# EAGLE design TSAL_logic_TNN_V1.0 (EAGLE 9.6.2)
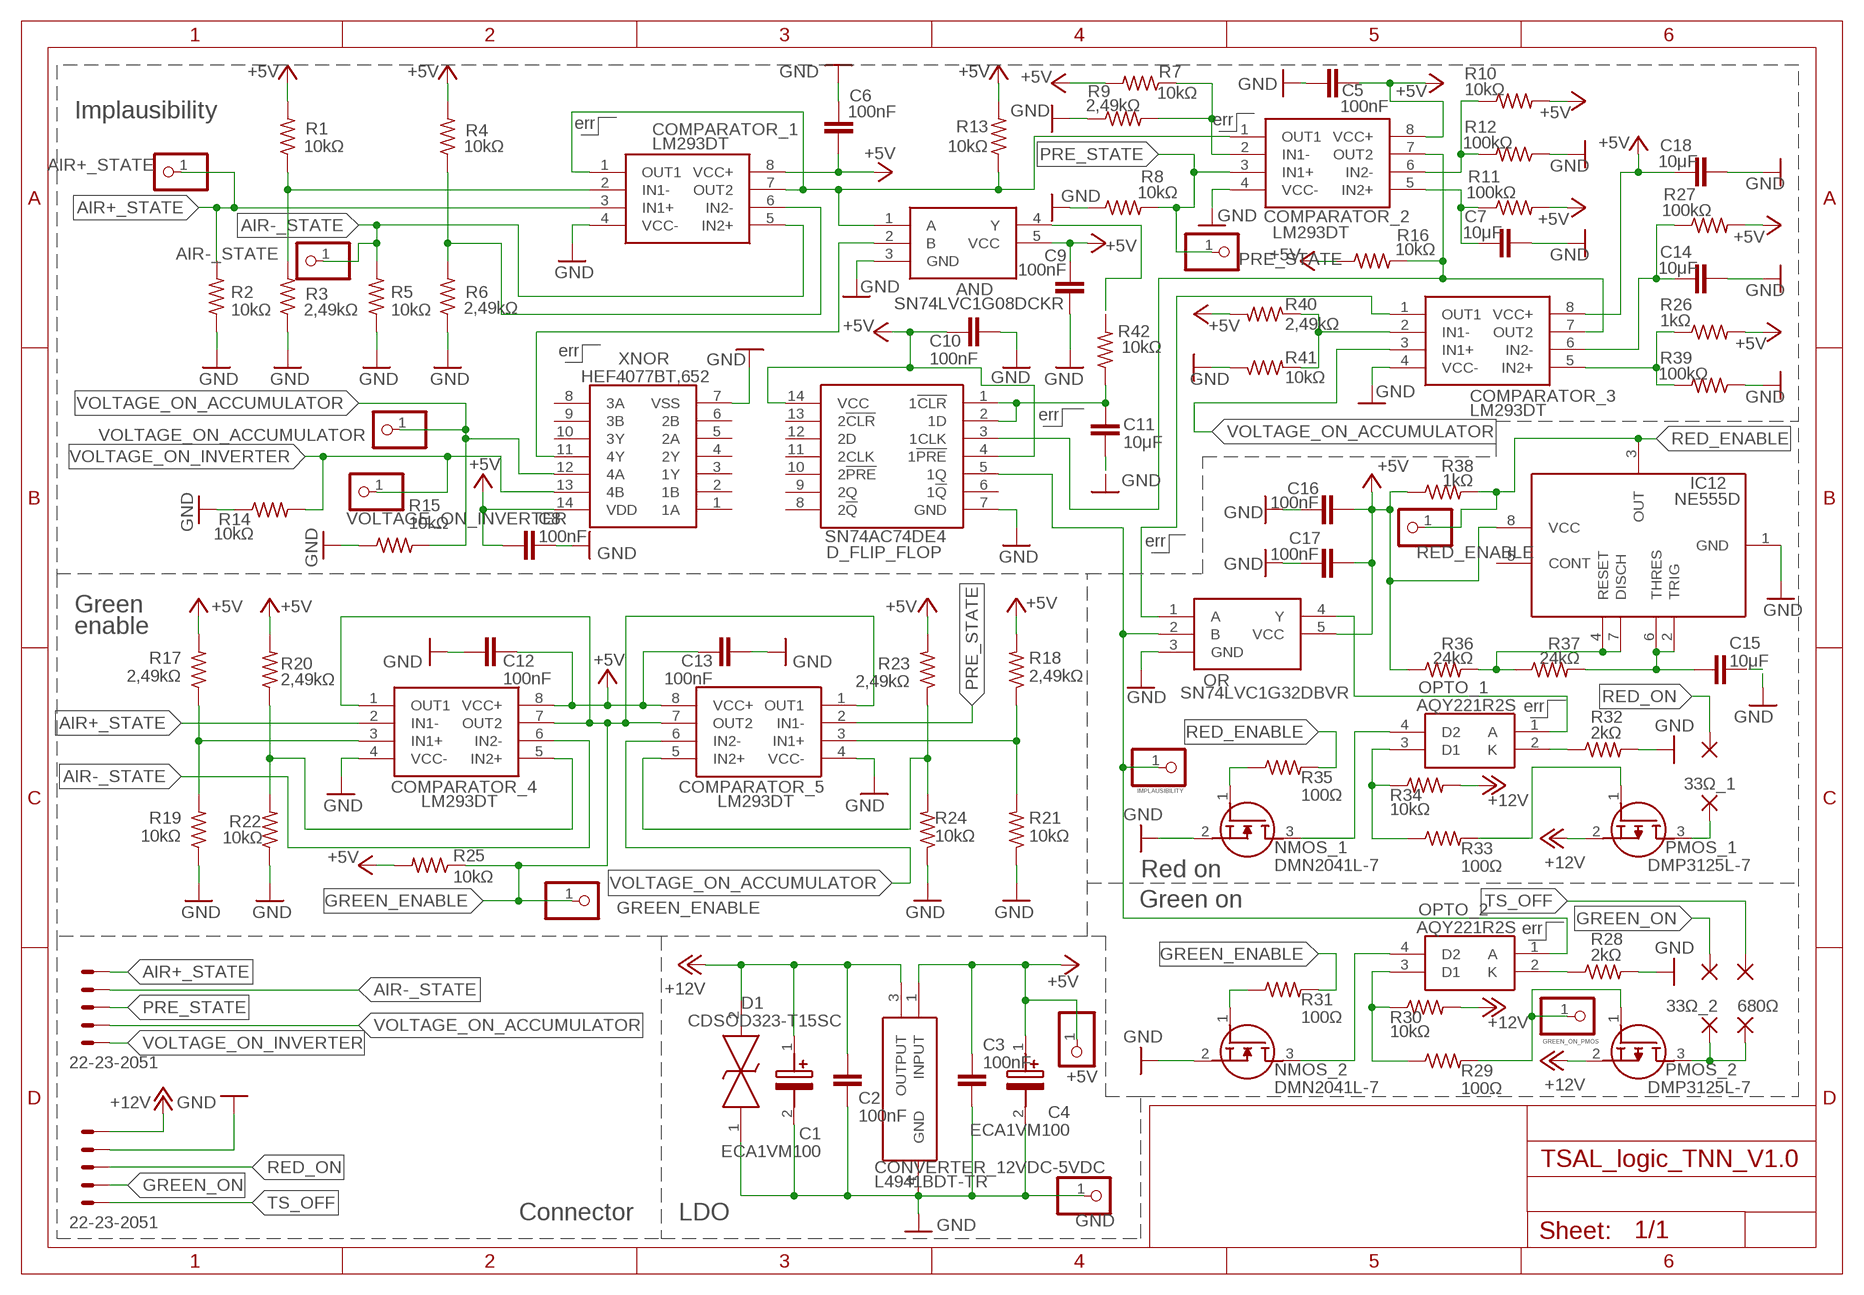
[diagram p0: schematic, sheet 1]

## Parts
33Ω_1  1,6/0,8  [1,6/0,8]
33Ω_1_  1,6/0,8  [1,6/0,8]
33Ω_2  1,6/0,8  [1,6/0,8]
33Ω_2_  1,6/0,8  [1,6/0,8]
680Ω  1,6/0,8  [1,6/0,8]
680Ω_  1,6/0,8  [1,6/0,8]
+5V  PINHD-1X1  [1X01]
AIR+_STATE  PINHD-1X1  [1X01]
AIR-_STATE  PINHD-1X1  [1X01]
AND  SN74LVC1G08DCKR  [SOT65P210X110-5N]
C1  ECA1VM100  [CAPPRD200W55D525H1200]
C2  100nF  C-EUC0603  [C0603]
C3  100nF  C-EUC0603  [C0603]
C4  ECA1VM100  [CAPPRD200W55D525H1200]
C5  100nF  C-EUC0603  [C0603]
C6  100nF  C-EUC0603  [C0603]
C7  10μF  C-EUC0603  [C0603]
C8  100nF  C-EUC0603  [C0603]
C9  100nF  C-EUC0603  [C0603]
C10  100nF  C-EUC0603  [C0603]
C11  10μF  C-EUC0603  [C0603]
C12  100nF  C-EUC0603  [C0603]
C13  100nF  C-EUC0603  [C0603]
C14  10μF  C-EUC0603  [C0603]
C15  10μF  C-EUC0603  [C0603]
C16  100nF  C-EUC0603  [C0603]
C17  100nF  C-EUC0603  [C0603]
C18  10μF  C-EUC0603  [C0603]
COMPARATOR_1  LM293DT  [SOIC127P600X175-8N]
COMPARATOR_2  LM293DT  [SOIC127P600X175-8N]
COMPARATOR_3  LM293DT  [SOIC127P600X175-8N]
COMPARATOR_4  LM293DT  [SOIC127P600X175-8N]
COMPARATOR_5  LM293DT  [SOIC127P600X175-8N]
CONTACTOR_STATE_AND_VOLTAGE_MEASUREMENT  22-23-2051  [22-23-2051]
CONVERTER_12VDC-5VDC  L4941BDT-TR  [TO228P972X240-3N]
D1  CDSOD323-T15SC  [SOD-323]
D_FLIP_FLOP  SN74AC74DE4  [SOIC127P600X175-14N]
GND  PINHD-1X1  [1X01]
GREEN_ENABLE  PINHD-1X1  [1X01]
GREEN_ON_PMOS  PINHD-1X1  [1X01]
IC12  NE555D  [SOIC127P600X175-8N]
IMPLAUSIBILITY  PINHD-1X1  [1X01]
NMOS_1  DMN2041L-7  [SOT96P240X110-3N]
NMOS_2  DMN2041L-7  [SOT96P240X110-3N]
OPTO_1  AQY221R2S  [SOP254P680X230-4N]
OPTO_2  AQY221R2S  [SOP254P680X230-4N]
OR  SN74LVC1G32DBVR  [SOT95P280X145-5N]
PMOS_1  DMP3125L-7  [SOT96P240X110-3N]
PMOS_2  DMP3125L-7  [SOT96P240X110-3N]
PRE_STATE  PINHD-1X1  [1X01]
R1  10kΩ  R-US_R0603  [R0603]
R2  10kΩ  R-US_R0603  [R0603]
R3  2,49kΩ  R-US_R0603  [R0603]
R4  10kΩ  R-US_R0603  [R0603]
R5  10kΩ  R-US_R0603  [R0603]
R6  2,49kΩ  R-US_R0603  [R0603]
R7  10kΩ  R-US_R0603  [R0603]
R8  10kΩ  R-US_R0603  [R0603]
R9  2,49kΩ  R-US_R0603  [R0603]
R10  10kΩ  R-US_R0603  [R0603]
R11  100kΩ  R-US_R0603  [R0603]
R12  100kΩ  R-US_R0603  [R0603]
R13  10kΩ  R-US_R0603  [R0603]
R14  10kΩ  R-US_R0603  [R0603]
R15  10kΩ  R-US_R0603  [R0603]
R16  10kΩ  R-US_R0603  [R0603]
R17  2,49kΩ  R-US_R0603  [R0603]
R18  2,49kΩ  R-US_R0603  [R0603]
R19  10kΩ  R-US_R0603  [R0603]
R20  2,49kΩ  R-US_R0603  [R0603]
R21  10kΩ  R-US_R0603  [R0603]
R22  10kΩ  R-US_R0603  [R0603]
R23  2,49kΩ  R-US_R0603  [R0603]
R24  10kΩ  R-US_R0603  [R0603]
R25  10kΩ  R-US_R0603  [R0603]
R26  1kΩ  R-US_R0603  [R0603]
R27  100kΩ  R-US_R0603  [R0603]
R28  2kΩ  R-US_R0603  [R0603]
R29  100Ω  R-US_R0603  [R0603]
R30  10kΩ  R-US_R0603  [R0603]
R31  100Ω  R-US_R0603  [R0603]
R32  2kΩ  R-US_R0603  [R0603]
R33  100Ω  R-US_R0603  [R0603]
R34  10kΩ  R-US_R0603  [R0603]
R35  100Ω  R-US_R0603  [R0603]
R36  24kΩ  R-US_R0603  [R0603]
R37  24kΩ  R-US_R0603  [R0603]
R38  1kΩ  R-US_R0603  [R0603]
R39  100kΩ  R-US_R0603  [R0603]
R40  2,49kΩ  R-US_R0603  [R0603]
R41  10kΩ  R-US_R0603  [R0603]
R42  10kΩ  R-US_R0603  [R0603]
RED_ENABLE  PINHD-1X1  [1X01]
TSAL_LED_AND_POWER  22-23-2051  [22-23-2051]
VOLTAGE_ON_ACCUMULATOR  PINHD-1X1  [1X01]
VOLTAGE_ON_INVERTER  PINHD-1X1  [1X01]
XNOR  HEF4077BT,652  [SOIC127P600X175-14N]

## Nets
+5V: +5V.1 AND.5(VCC) C3.1 C4.1(+) C5.2 C6.2 C8.1 C9.1 C10.1 C12.1 C13.1 C16.1 C17.1 C18.1 COMPARATOR_1.8(VCC+) COMPARATOR_2.8(VCC+) COMPARATOR_3.8(VCC+) COMPARATOR_4.8(VCC+) COMPARATOR_5.8(VCC+) CONVERTER_12VDC-5VDC.1(INPUT) D_FLIP_FLOP.4(1!PRE) D_FLIP_FLOP.14(VCC) IC12.8(VCC) OR.5(VCC) R1.2 R4.2 R7.2 R10.2 R11.2 R13.2 R16.1 R17.2 R18.2 R20.2 R23.2 R25.2 R26.2 R27.2 R36.1 R38.1 R40.2 XNOR.14(VDD)
+12V: C1.1(+) C2.1 CONVERTER_12VDC-5VDC.3(OUTPUT) D1.2 PMOS_1.2(S) PMOS_2.2(S) R30.2 R34.2 TSAL_LED_AND_POWER.5
AIR+_STATE: AIR+_STATE.1 COMPARATOR_1.3(IN1+) COMPARATOR_4.2(IN1-) CONTACTOR_STATE_AND_VOLTAGE_MEASUREMENT.5 R2.2
AIR-_STATE: AIR-_STATE.1 COMPARATOR_1.5(IN2+) COMPARATOR_4.6(IN2-) CONTACTOR_STATE_AND_VOLTAGE_MEASUREMENT.4 R5.2
GND: AND.3(GND) C1.2(-) C2.2 C3.2 C4.2(-) C5.1 C6.1 C7.2 C8.2 C9.2 C10.2 C11.2 C12.2 C13.2 C14.2 C15.2 C16.2 C17.2 C18.2 COMPARATOR_1.4(VCC-) COMPARATOR_2.4(VCC-) COMPARATOR_3.4(VCC-) COMPARATOR_4.4(VCC-) COMPARATOR_5.4(VCC-) CONVERTER_12VDC-5VDC.4(GND) D1.1 D_FLIP_FLOP.7(GND) GND.1 IC12.1(GND) NMOS_1.2(S) NMOS_2.2(S) OR.3(GND) R2.1 R3.1 R5.1 R6.1 R8.1 R9.1 R12.1 R14.1 R15.1 R19.1 R21.1 R22.1 R24.1 R28.2 R32.2 R39.1 R41.1 TSAL_LED_AND_POWER.4 XNOR.7(VSS)
GREEN_ENABLE: COMPARATOR_4.1(OUT1) COMPARATOR_4.7(OUT2) COMPARATOR_5.1(OUT1) COMPARATOR_5.7(OUT2) GREEN_ENABLE.1 R25.1 R31.2
GREEN_ON: 33Ω_2_.1(P) TSAL_LED_AND_POWER.2
IMPLAUSIBILITY: D_FLIP_FLOP.5(1Q) IMPLAUSIBILITY.1 OPTO_2.1(A) OR.2(B)
N$1: COMPARATOR_1.2(IN1-) R1.1 R3.2
N$2: AND.1(A) COMPARATOR_1.1(OUT1) COMPARATOR_1.7(OUT2) COMPARATOR_2.1(OUT1) R13.1
N$3: COMPARATOR_1.6(IN2-) R4.1 R6.2
N$4: COMPARATOR_2.2(IN1-) R7.1 R9.2
N$5: COMPARATOR_2.6(IN2-) R10.1 R12.2
N$6: C7.1 COMPARATOR_2.5(IN2+) R11.1
N$7: COMPARATOR_2.7(OUT2) COMPARATOR_3.7(OUT2) D_FLIP_FLOP.3(1CLK) R16.2
N$8: AND.2(B) XNOR.11(4Y)
N$9: COMPARATOR_5.5(IN2+) R23.1 R24.2
N$10: COMPARATOR_5.3(IN1+) R18.1 R21.2
N$11: COMPARATOR_4.3(IN1+) R17.1 R19.2
N$12: COMPARATOR_4.5(IN2+) R20.1 R22.2
N$14: COMPARATOR_3.5(IN2+) R26.1 R39.2
N$15: 33Ω_2.1(P) 680Ω.1(P) PMOS_2.3(D)
N$16: OPTO_2.2(K) R28.1
N$17: 33Ω_1.1(P) PMOS_1.3(D)
N$18: NMOS_2.3(D) OPTO_2.4(D2)
N$19: OPTO_2.3(D1) R29.1 R30.1
N$20: GREEN_ON_PMOS.1 PMOS_2.1(G) R29.2
N$21: NMOS_2.1(G) R31.1
N$22: NMOS_1.3(D) OPTO_1.4(D2)
N$23: OPTO_1.3(D1) R33.1 R34.1
N$24: PMOS_1.1(G) R33.2
N$25: NMOS_1.1(G) R35.1
N$26: OPTO_1.2(K) R32.1
N$27: COMPARATOR_3.1(OUT1) OR.1(A)
N$28: OPTO_1.1(A) OR.4(Y)
N$30: C14.1 COMPARATOR_3.6(IN2-) R27.1
N$31: C15.1 IC12.2(TRIG) IC12.6(THRES) R37.2
N$32: IC12.4(RESET) IC12.7(DISCH) R36.2 R37.1
N$33: COMPARATOR_3.2(IN1-) R40.1 R41.2
N$34: C11.1 D_FLIP_FLOP.1(1!CLR) D_FLIP_FLOP.2(1D) R42.1
N$35: AND.4(Y) R42.2
PRE_STATE: COMPARATOR_2.3(IN1+) COMPARATOR_5.2(IN1-) CONTACTOR_STATE_AND_VOLTAGE_MEASUREMENT.3 PRE_STATE.1 R8.2
RED_ENABLE: IC12.3(OUT) R35.2 R38.2 RED_ENABLE.1
RED_ON: 33Ω_1_.1(P) TSAL_LED_AND_POWER.3
TS_OFF: 680Ω_.1(P) TSAL_LED_AND_POWER.1
VOLTAGE_ON_ACCUMULATOR: COMPARATOR_3.3(IN1+) COMPARATOR_5.6(IN2-) CONTACTOR_STATE_AND_VOLTAGE_MEASUREMENT.2 R15.2 VOLTAGE_ON_ACCUMULATOR.1 XNOR.12(4A)
VOLTAGE_ON_INVERTER: CONTACTOR_STATE_AND_VOLTAGE_MEASUREMENT.1 R14.2 VOLTAGE_ON_INVERTER.1 XNOR.13(4B)
Unconnected: D_FLIP_FLOP.6(1!Q) D_FLIP_FLOP.8(2!Q) D_FLIP_FLOP.9(2Q) D_FLIP_FLOP.10(2!PRE) D_FLIP_FLOP.11(2CLK) D_FLIP_FLOP.12(2D) D_FLIP_FLOP.13(2!CLR) IC12.5(CONT) XNOR.1(1A) XNOR.2(1B) XNOR.3(1Y) XNOR.4(2Y) XNOR.5(2A) XNOR.6(2B) XNOR.8(3A) XNOR.9(3B) XNOR.10(3Y)

## Notes on the sheet
- err | err
- Implausibility
- err
- err
- err
- Green 
  enable
- err
- Red on
- Green on
- err
- Connector | LDO

## Library data of the parts
33Ω_1 33Ω_1_ 33Ω_2 33Ω_2_ 680Ω 680Ω_ = wirepad:1,6/0,8: THROUGH-HOLE PAD
+5V AIR+_STATE AIR-_STATE GND GREEN_ENABLE GREEN_ON_PMOS IMPLAUSIBILITY PRE_STATE RED_ENABLE VOLTAGE_ON_ACCUMULATOR VOLTAGE_ON_INVERTER = pinhead:PINHD-1X1: PIN HEADER
AND = SN74LVC1G08DCKR:SN74LVC1G08DCKR: Single 2-Input Positive-AND Gate Source: Datasheet <http://www.ti.com/lit/gpn/sn74lvc1g08>; ARROW_PART_NUMBER: SN74LVC1G08DCKR; ARROW_PRICE-STOCK: https://www.arrow.com/en/products/sn74lvc1g08dckr/texas-instruments?region=nac; DESCRIPTION: Single 2-Input Positive-AND Gate; HEIGHT: 1.1mm; MANUFACTURER_NAME: Texas Instruments; MANUFACTURER_PART_NUMBER: SN74LVC1G08DCKR; MOUSER_PART_NUMBER: 595-SN74LVC1G08DCKR; MOUSER_PRICE-STOCK: https://www.mouser.co.uk/ProductDetail/Texas-Instruments/SN74LVC1G08DCKR?qs=sbcp%2F4gpy0%2F8FFQ%252BRQ5MTw%3D%3D
C1 C4 = ECA1VM100:ECA1VM100: M radial Al elect cap,10uF 35V 85deg C Panasonic 10uF 35 V dc Aluminium Electrolytic Capacitor, M Series 2000h Source: Datasheet <http://industrial.panasonic.com/cdbs/www-data/pdf/RDF0000/ABA0000C1218.pdf>; DESCRIPTION: M radial Al elect cap,10uF 35V 85deg C Panasonic 10uF 35 V dc Aluminium Electrolytic Capacitor, M Series 2000h; HEIGHT: 12mm; MANUFACTURER_NAME: Panasonic; MANUFACTURER_PART_NUMBER: ECA1VM100
C2 C3 C5-C18 = rcl:C-EU: CAPACITOR, European symbol; SPICEPREFIX: C
COMPARATOR_1-COMPARATOR_5 = LM293DT:LM293DT: Low power dual voltage comparators Source: Datasheet <http://www.st.com/web/en/resource/technical/document/datasheet/CD00000465.pdf>; ARROW_PART_NUMBER: LM293DT; ARROW_PRICE-STOCK: https://www.arrow.com/en/products/lm293dt/stmicroelectronics?region=europe; DESCRIPTION: Low power dual voltage comparators; HEIGHT: 1.75mm; MANUFACTURER_NAME: STMicroelectronics; MANUFACTURER_PART_NUMBER: LM293DT; MOUSER_PART_NUMBER: 511-LM293DT; MOUSER_PRICE-STOCK: https://www.mouser.co.uk/ProductDetail/STMicroelectronics/LM293DT?qs=8Bu%252BF5HPnlzADNRUf2Meow%3D%3D
CONTACTOR_STATE_AND_VOLTAGE_MEASUREMENT TSAL_LED_AND_POWER = con-molex:22-23-2051: .100" (2.54mm) Center Header - 5 Pin; MF: MOLEX; MPN: 22-23-2051; OC_FARNELL: 1462952; OC_NEWARK: 38C9178
CONVERTER_12VDC-5VDC = L4941BDT-TR:L4941BDT-TR: L4941BDT-TR, Low Dropout Voltage Regulator, 1A, 5 V +/-4%, 3-Pin DPAK Source: Datasheet <http://www.st.com/web/en/resource/technical/document/datasheet/CD00000443.pdf>; ARROW_PART_NUMBER: L4941BDT-TR; ARROW_PRICE-STOCK: https://www.arrow.com/en/products/l4941bdt-tr/stmicroelectronics?region=nac; DESCRIPTION: L4941BDT-TR, Low Dropout Voltage Regulator, 1A, 5 V +/-4%, 3-Pin DPAK; HEIGHT: 2.4mm; MANUFACTURER_NAME: STMicroelectronics; MANUFACTURER_PART_NUMBER: L4941BDT-TR; MOUSER_PART_NUMBER: 511-L4941BDT-TR; MOUSER_PRICE-STOCK: https://www.mouser.co.uk/ProductDetail/STMicroelectronics/L4941BDT-TR?qs=tPFdqECvbMIySYN92F2N4Q%3D%3D
D1 = CDSOD323-T15SC:CDSOD323-T15SC: TVS Diode ESD 15V BiDirectional SOD323 Bourns CDSOD323-T15SC Bi-Directional TVS Diode, 400W peak, 2-Pin SOD-323 Source: Datasheet <https://datasheet.datasheetarchive.com/originals/distributors/Datasheets-DGA26/1841678.pdf>; ARROW_PART_NUMBER: CDSOD323-T15SC; ARROW_PRICE-STOCK: https://www.arrow.com/en/products/cdsod323-t15sc/bourns?region=nac; DESCRIPTION: TVS Diode ESD 15V BiDirectional SOD323 Bourns CDSOD323-T15SC Bi-Directional TVS Diode, 400W peak, 2-Pin SOD-323; HEIGHT: mm; MANUFACTURER_NAME: Bourns; MANUFACTURER_PART_NUMBER: CDSOD323-T15SC; MOUSER_PART_NUMBER: 652-CDSOD323-T15SC; MOUSER_PRICE-STOCK: https://www.mouser.co.uk/ProductDetail/Bourns/CDSOD323-T15SC?qs=6S5Watp5UnLvz%2FtnS7XuhA%3D%3D
D_FLIP_FLOP = SN74AC74DE4:SN74AC74DE4: Flip-Flops Dual Pos-Edge-Trig D-Type Flip-Flop Source: Datasheet <http://www.ti.com/general/docs/suppproductinfo.tsp?distId=26&gotoUrl=http://www.ti.com/lit/gpn/sn74ac74>; DESCRIPTION: Flip-Flops Dual Pos-Edge-Trig D-Type Flip-Flop; HEIGHT: 1.75mm; MANUFACTURER_NAME: Texas Instruments; MANUFACTURER_PART_NUMBER: SN74AC74DE4; MOUSER_PART_NUMBER: 595-SN74AC74DE4; MOUSER_PRICE-STOCK: https://www.mouser.co.uk/ProductDetail/Texas-Instruments/SN74AC74DE4?qs=pdM4geFiyZSonhSZLAytyw%3D%3D
IC12 = NE555D:NE555D: NE555DG4, Timer, 4.5 to 16V, 8-Pin SOIC-8 Source: Datasheet <http://www.ti.com/lit/ds/symlink/ne555.pdf>; ARROW_PART_NUMBER: NE555D; ARROW_PRICE-STOCK: https://www.arrow.com/en/products/ne555d/texas-instruments?region=nac; DESCRIPTION: NE555DG4, Timer, 4.5 to 16V, 8-Pin SOIC-8; HEIGHT: 1.75mm; MANUFACTURER_NAME: Texas Instruments; MANUFACTURER_PART_NUMBER: NE555D; MOUSER_PART_NUMBER: 595-NE555D; MOUSER_PRICE-STOCK: https://www.mouser.co.uk/ProductDetail/Texas-Instruments/NE555D?qs=gb35HGp1gQIV8t3Z88o0WA%3D%3D
NMOS_1 NMOS_2 = DMN2041L-7:DMN2041L-7: Diodes Inc DMN2041L-7 N-channel MOSFET Transistor, 6.4 A, 20 V, 3-Pin SOT-23 Source: Datasheet <https://datasheet.datasheetarchive.com/originals/distributors/Datasheets-DGA23/1582050.pdf>; ARROW_PART_NUMBER: DMN2041L-7; ARROW_PRICE-STOCK: https://www.arrow.com/en/products/dmn2041l-7/diodes-incorporated?region=nac; DESCRIPTION: Diodes Inc DMN2041L-7 N-channel MOSFET Transistor, 6.4 A, 20 V, 3-Pin SOT-23; HEIGHT: 1.1mm; MANUFACTURER_NAME: Diodes Inc.; MANUFACTURER_PART_NUMBER: DMN2041L-7; MOUSER_PART_NUMBER: 621-DMN2041L-7; MOUSER_PRICE-STOCK: https://www.mouser.co.uk/ProductDetail/Diodes-Incorporated/DMN2041L-7?qs=tiksPeNXt0LSbn3jTreVOg%3D%3D
OPTO_1 OPTO_2 = AQY221R2S:AQY221R2S: SPST-NO Solid State Relay 250 mA PCB Mount PhotoMOS, 1.5 V Source: Datasheet <https://datasheet.datasheetarchive.com/originals/distributors/SFDatasheet-4/sf-00084072.pdf>; ARROW_PART_NUMBER: AQY221R2S; ARROW_PRICE-STOCK: https://www.arrow.com/en/products/aqy221r2s/panasonic; DESCRIPTION: SPST-NO Solid State Relay 250 mA PCB Mount PhotoMOS, 1.5 V; HEIGHT: 2.3mm; MANUFACTURER_NAME: Panasonic; MANUFACTURER_PART_NUMBER: AQY221R2S; MOUSER_PART_NUMBER: 769-AQY221R2S; MOUSER_PRICE-STOCK: https://www.mouser.co.uk/ProductDetail/Panasonic-Industrial-Devices/AQY221R2S?qs=mTeSeKeuVA570TSPtWARNQ%3D%3D
OR = SN74LVC1G32DBVR:SN74LVC1G32DBVR: Texas Instruments SN74LVC1G32DBVR, 2-Input OR Logic Gate, 1.65 5.5 V, 5-Pin SOT-23 Source: Datasheet <http://www.ti.com/lit/gpn/sn74lvc1g32>; ARROW_PART_NUMBER: SN74LVC1G32DBVR; ARROW_PRICE-STOCK: https://www.arrow.com/en/products/sn74lvc1g32dbvr/texas-instruments?region=nac; DESCRIPTION: Texas Instruments SN74LVC1G32DBVR, 2-Input OR Logic Gate, 1.65 5.5 V, 5-Pin SOT-23; HEIGHT: 1.45mm; MANUFACTURER_NAME: Texas Instruments; MANUFACTURER_PART_NUMBER: SN74LVC1G32DBVR; MOUSER_PART_NUMBER: 595-SN74LVC1G32DBVR; MOUSER_PRICE-STOCK: https://www.mouser.co.uk/ProductDetail/Texas-Instruments/SN74LVC1G32DBVR?qs=3pnr37ZAbK%2F6ArGi%2FPb2Ng%3D%3D
PMOS_1 PMOS_2 = DMP3125L-7:DMP3125L-7: DMP3125L-7 P-Channel MOSFET, 2 (State) A, 2.5 (Steady) A, 30 V, 3-Pin SOT-23 Diodes Inc Source: Datasheet <http://uk.rs-online.com/web/p/products/1826917>; ARROW_PART_NUMBER: DMP3125L-7; ARROW_PRICE-STOCK: https://www.arrow.com/en/products/dmp3125l-7/diodes-incorporated; DESCRIPTION: DMP3125L-7 P-Channel MOSFET, 2 (State) A, 2.5 (Steady) A, 30 V, 3-Pin SOT-23 Diodes Inc; HEIGHT: 1.1mm; MANUFACTURER_NAME: Diodes Inc.; MANUFACTURER_PART_NUMBER: DMP3125L-7; MOUSER_PART_NUMBER: 621-DMP3125L-7; MOUSER_PRICE-STOCK: https://www.mouser.co.uk/ProductDetail/Diodes-Incorporated/DMP3125L-7?qs=W0yvOO0ixfH8ma8MdHfXQA%3D%3D
R1-R42 = rcl:R-US_: RESISTOR, American symbol; SPICEPREFIX: R
XNOR = HEF4077BT_652:HEF4077BT,652: NXP HEF4077BT,652, XNOR Quad 2 Input XNOR, 3 15 V, 14-Pin SOIC Source: Datasheet <https://assets.nexperia.com/documents/data-sheet/HEF4077B.pdf>; ARROW_PART_NUMBER: HEF4077BT,652; ARROW_PRICE-STOCK: https://www.arrow.com/en/products/hef4077bt652/nexperia; DESCRIPTION: NXP HEF4077BT,652, XNOR Quad 2 Input XNOR, 3 15 V, 14-Pin SOIC; HEIGHT: 1.75mm; MANUFACTURER_NAME: Nexperia; MANUFACTURER_PART_NUMBER: HEF4077BT,652; MOUSER_PART_NUMBER: 771-HEF4077BTD; MOUSER_PRICE-STOCK: https://www.mouser.com/Search/Refine.aspx?Keyword=771-HEF4077BTD

## Board
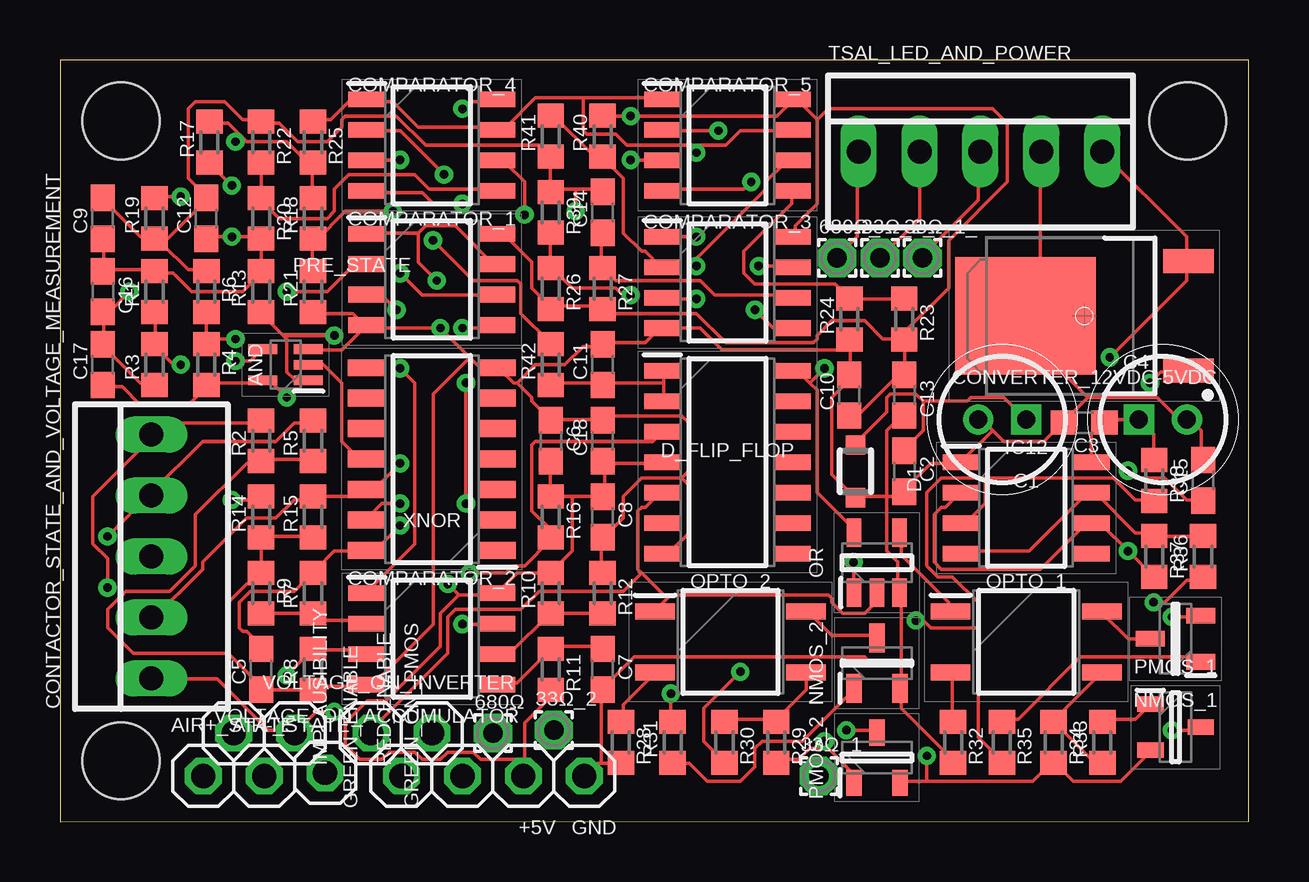
[diagram p1: board, top side]
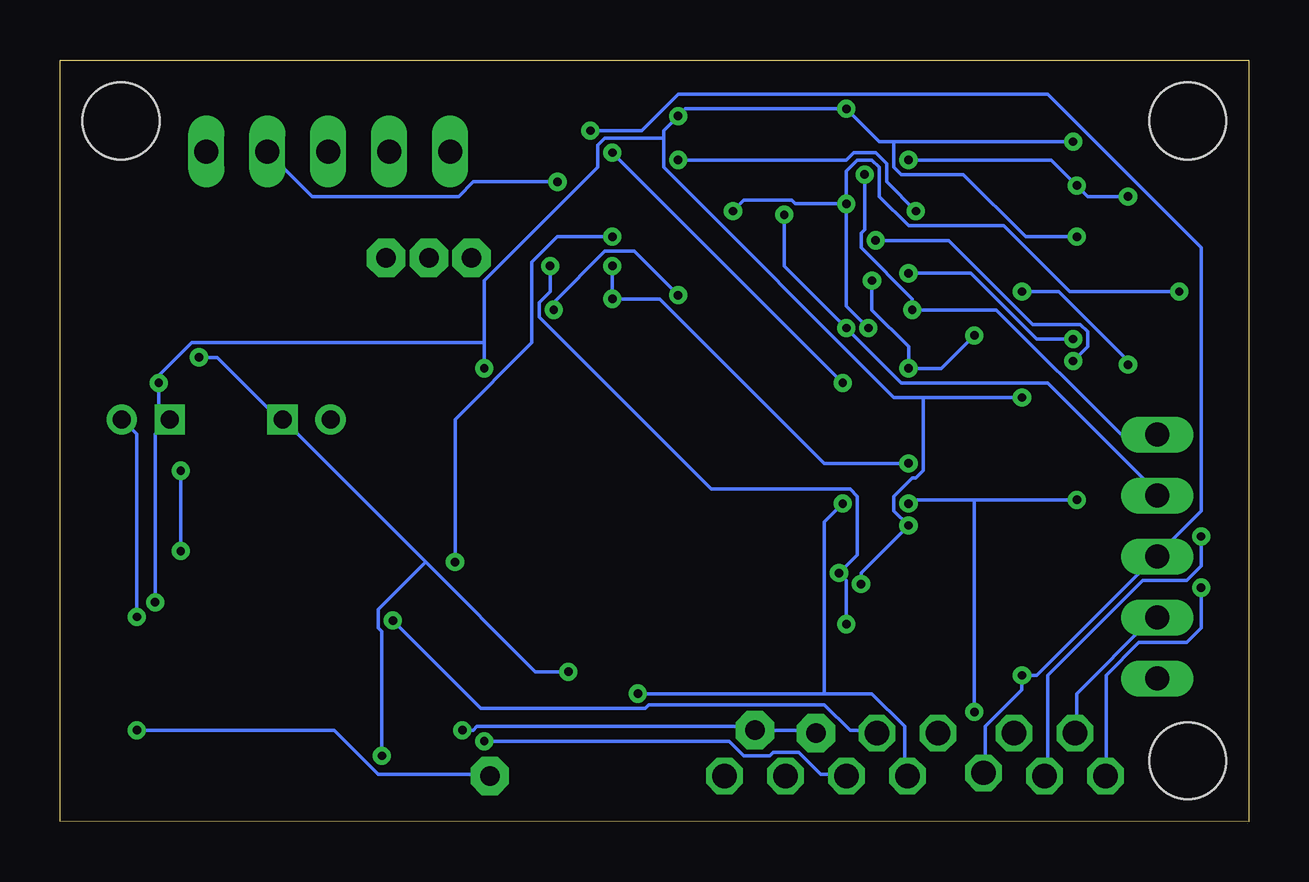
[diagram p2: board, bottom side, seen from below]

Size 49.53 x 31.75 mm. Coordinates in mm from the lower left corner, seen from the top.
Outline: 0,0 49.53,0.01 49.53,31.75 0,31.74 0,0
Copper layers (1*16): Top 0.035mm / dielectric 1.5mm / Bottom 0.035mm
Design rules "default": minimum track width 6mil, minimum drill 0.35mm, track to track 6mil, track to pad 6mil, pad to pad 6mil, via to via 6mil, smd to smd 6mil, copper to edge 40mil, drill to drill 6mil, minimum pad ring 10mil, minimum via ring 8mil, stop-mask expansion 4mil, vias tented up to drill 0mil, thermal gap 10mil
Holes 3.2 mm at 2.54,2.54 46.99,29.21 2.54,29.21

### Footprints (pad centres in the part's own frame; a part is rotated, then mirrored left to right if it is on the bottom)
1,6/0,8 = drill 0.813 pad 1.6 octagon: 1 0,0
1X01 = drill 1.016 octagon: 1 0,0
SOT65P210X110-5N = smd 1.2 x 0.4: 1 -0.95,0.65; 2 -0.95,0; 3 -0.95,-0.65; 4 0.95,-0.65; 5 0.95,0.65
CAPPRD200W55D525H1200 = drill 0.75 pad 1.15 square: 1 0,0 | drill 0.75 pad 1.15: 2 2,0
C0603 = smd 1.1 x 1: 1 -0.85,0; 2 0.85,0
SOIC127P600X175-8N = smd 1.525 x 0.65: 1 -2.712,1.905; 2 -2.712,0.635; 3 -2.712,-0.635; 4 -2.712,-1.905; 5 2.712,-1.905; 6 2.712,-0.635; 7 2.712,0.635; 8 2.712,1.905
22-23-2051 = drill 1 long: 1 -5.08,0; 2 -2.54,0; 3 0,0; 4 2.54,0; 5 5.08,0
TO228P972X240-3N = smd 2.1 x 1: 1 -4.35,2.28; 3 -4.35,-2.28 | smd 5.85 x 4.9: 4 2.45,0
SOD-323 = smd 0.8 x 0.8: 1 -1.1,0; 2 1.1,0
SOIC127P600X175-14N = smd 1.525 x 0.65: 1 -2.712,3.81; 2 -2.712,2.54; 3 -2.712,1.27; 4 -2.712,0; 5 -2.712,-1.27; 6 -2.712,-2.54; 7 -2.712,-3.81; 8 2.712,-3.81; 9 2.712,-2.54; 10 2.712,-1.27; 11 2.712,0; 12 2.712,1.27; 13 2.712,2.54; 14 2.712,3.81
SOIC127P600X175-8N' = smd 1.528 x 0.65: 1 -2.711,1.905; 2 -2.711,0.635; 3 -2.711,-0.635; 4 -2.711,-1.905; 5 2.711,-1.905; 6 2.711,-0.635; 7 2.711,0.635; 8 2.711,1.905
SOT96P240X110-3N = smd 1.2 x 0.65: 1 -1.05,0.96; 2 -1.05,-0.96; 3 1.05,0
SOP254P680X230-4N = smd 1.65 x 0.65: 1 -3.15,1.27; 2 -3.15,-1.27; 3 3.15,-1.27; 4 3.15,1.27
SOT95P280X145-5N = smd 1.2 x 0.6: 1 -1.25,0.95; 2 -1.25,0; 3 -1.25,-0.95; 4 1.25,-0.95; 5 1.25,0.95
SOT96P240X110-3N' = smd 1.1 x 0.65: 1 -1.05,0.96; 2 -1.05,-0.96; 3 1.05,0
R0603 = smd 1 x 1.1: 1 -0.85,0; 2 0.85,0
SOIC127P600X175-14N' = smd 1.55 x 0.7: 1 -2.725,3.81; 2 -2.725,2.54; 3 -2.725,1.27; 4 -2.725,0; 5 -2.725,-1.27; 6 -2.725,-2.54; 7 -2.725,-3.81; 8 2.725,-3.81; 9 2.725,-2.54; 10 2.725,-1.27; 11 2.725,0; 12 2.725,1.27; 13 2.725,2.54; 14 2.725,3.81

### Placement (x,y rotation side)
33Ω_1  31.62,1.91 0 top
33Ω_1_  35.94,23.5 0 top
33Ω_2  20.57,3.81 0 top
33Ω_2_  34.16,23.5 0 top
680Ω  18.03,3.68 0 top
680Ω_  32.38,23.5 0 top
+5V  19.3,1.91 180 top
AIR+_STATE  5.97,1.91 0 top
AIR-_STATE  8.51,1.91 0 top
AND  9.4,19.05 180 top
C1  40.26,16.76 180 top
C2  35.18,14.61 270 top
C3  42.67,16.64 180 top
C4  44.96,16.76 0 top
C5  8.38,6.35 90 top
C6  20.45,15.88 270 top
C7  22.61,6.35 270 top
C8  22.61,12.7 270 top
C9  1.78,25.15 90 top
C10  32.89,17.78 90 top
C11  22.61,19.05 90 top
C12  6.1,25.15 90 top
C13  35.18,17.78 270 top
C14  22.61,25.4 90 top
C15  47.62,14.22 90 top
C16  1.78,22.1 270 top
C17  1.78,19.05 90 top
C18  22.61,15.88 90 top
COMPARATOR_1  15.49,22.61 0 top
COMPARATOR_2  15.49,7.62 0 top
COMPARATOR_3  27.81,22.48 0 top
COMPARATOR_4  15.49,28.19 0 top
COMPARATOR_5  27.81,28.19 0 top
CONTACTOR_STATE_AND_VOLTAGE_MEASUREMENT  3.81,11.05 90 top
CONVERTER_12VDC-5VDC  42.67,21.08 180 top
D1  33.15,14.61 90 top
D_FLIP_FLOP  27.81,14.99 0 top
GND  21.84,1.91 180 top
GREEN_ENABLE  14.22,1.91 90 top
GREEN_ON_PMOS  16.76,1.91 90 top
IC12  NE555D  [SOIC127P600X175-8N']  40.26,13.08 0 top
IMPLAUSIBILITY  12.95,3.68 90 top
NMOS_1  46.48,7.62 180 top
NMOS_2  34.04,6.6 90 top
OPTO_1  40.26,7.49 0 top
OPTO_2  27.94,7.49 0 top
OR  34.04,10.79 90 top
PMOS_1  DMP3125L-7  [SOT96P240X110-3N']  46.48,3.94 0 top
PMOS_2  DMP3125L-7  [SOT96P240X110-3N']  34.04,2.67 90 top
PRE_STATE  11.05,2.03 0 top
R1  3.94,22.1 90 top
R2  8.38,15.88 90 top
R3  3.94,19.05 90 top
R4  6.1,19.05 270 top
R5  10.54,15.88 90 top
R6  6.1,22.1 270 top
R7  10.54,9.53 90 top
R8  10.54,6.35 90 top
R9  8.38,9.53 270 top
R10  20.45,9.53 90 top
R11  20.45,6.35 270 top
R12  22.61,9.53 270 top
R13  8.38,22.1 90 top
R14  8.38,12.7 90 top
R15  10.54,12.7 90 top
R16  20.45,12.7 270 top
R17  6.22,28.32 90 top
R18  10.54,25.15 90 top
R19  3.94,25.15 90 top
R20  8.38,25.15 270 top
R21  10.54,22.1 90 top
R22  8.38,28.32 270 top
R23  35.18,20.95 270 top
R24  32.89,20.95 90 top
R25  10.54,28.32 270 top
R26  20.45,22.23 270 top
R27  22.61,22.23 270 top
R28  23.37,3.3 270 top
R29  29.84,3.3 270 top
R30  27.69,3.3 270 top
R31  25.53,3.3 90 top
R32  37.21,3.3 270 top
R33  43.43,3.3 90 top
R34  41.4,3.3 270 top
R35  39.24,3.3 270 top
R36  47.62,11.05 90 top
R37  45.59,11.05 270 top
R38  45.59,14.22 270 top
R39  20.45,25.4 270 top
R40  22.61,28.57 90 top
R41  20.45,28.57 90 top
R42  20.45,19.05 90 top
RED_ENABLE  15.49,3.68 90 top
TSAL_LED_AND_POWER  38.35,27.94 0 top
VOLTAGE_ON_ACCUMULATOR  7.24,3.68 0 top
VOLTAGE_ON_INVERTER  9.78,3.68 0 top
XNOR  HEF4077BT,652  [SOIC127P600X175-14N']  15.49,15.11 180 top

### Tracks (layer width: path | path; a pad name or v marks a point on that pad's centre or on a via)
+5V  (via drill 0.35)
  Top 0.152: 19.36,2.59 19.36,1.98 +5V.1 19.36,2.59 | 19.36,2.59 19.36,4.12 20.42,5.18 20.42,5.49 R11.2 | C6.2 20.42,14.94 20.42,13.56 R16.1 20.57,13.56 21.34,13.56 | 22.71,14.94 22.71,13.56 C8.1 22.55,13.56 21.34,13.56 | 22.71,14.94 24.99,14.94 D_FLIP_FLOP.4 | 22.71,14.94 C18.1 | 21.34,13.56 21.34,11.28 20.57,10.52 R10.2 20.42,10.36 19.05,10.36 18.29,9.6 COMPARATOR_2.8 18.14,9.45 16.61,9.45 | 19.36,2.59 17.53,2.59 17.22,2.9 16.15,2.9 15.85,2.59 15.09,2.59 14.78,2.9 13.72,2.9 13.41,2.59 12.5,2.59 11.89,3.2 11.89,4.12 12.8,5.03 13.56,5.03 15.85,7.32 15.85,8.69 16.61,9.45 | C10.1 32.92,17.07 33.38,17.07 35.05,18.75 C13.1 35.2,18.75 35.2,19.96 R23.2 | COMPARATOR_1.8 18.29,24.38 18.59,24.38 19.66,23.32 19.66,22.25 20.42,21.49 R26.2 20.57,21.49 22.55,21.49 R27.2 22.71,21.34 22.86,21.18 26.52,21.18 27.74,19.96 31.39,19.96 31.55,20.12 31.55,20.27 32.16,20.88 33.53,20.88 34.29,20.12 35.05,20.12 R23.2 | v45.57,9.14 46.02,9.14 46.94,10.06 47.55,10.06 R36.1 | R38.1 45.57,15.09 45.57,16.15 C4.1 43.59,16.76 C3.1 43.43,16.61 42.98,16.15 42.98,15.09 IC12.8 | v45.41,18.29 45.87,18.75 46.94,18.75 CONVERTER_12VDC-5VDC.1 | 31.24,18.29 30.63,18.9 D_FLIP_FLOP.14 | 31.24,18.29 31.55,17.98 31.55,13.72 33.07,12.19 OR.5 | C5.2 8.38,7.32 7.77,7.92 7.62,7.92 7.47,8.08 7.47,9.14 7.92,9.6 9.75,9.6 10.52,10.36 R7.2 10.67,10.52 11.43,11.28 12.65,11.28 XNOR.14 12.8,11.43 13.26,11.43 v14.17,12.34 | 1.83,23.01 1.83,24.23 C9.1 | 1.83,23.01 3.81,23.01 R1.2 3.96,22.86 4.72,22.86 5.49,22.1 7.62,22.1 8.38,22.86 R13.2 R20.2 8.38,24.38 v7.16,24.38 6.1,24.38 C12.1 | 1.83,23.01 C16.1 | 10.52,27.28 10.52,27.43 R25.2 10.52,27.28
  Top 0.152: 10.52,27.28 10.52,26.06 R18.2 | 7.47,28.65 7.77,28.35 9.45,28.35 10.52,27.28 | 7.47,28.65 7.01,29.11 6.25,29.11 R17.2 | C17.1 1.83,18.14 2.59,18.14 3.35,17.37 5.33,17.37 6.1,18.14 R4.2 6.1,18.29 8.38,18.29 AND.5 8.53,18.29 8.84,18.29 v9.45,17.68 | R40.2 22.71,29.41 v23.77,29.41 29.87,29.41 30.48,30.02 COMPARATOR_5.8 30.63,30.18 31.55,29.26 | v16.76,29.72 17.07,30.02 18.14,30.02 COMPARATOR_4.8 | 31.55,29.26 31.55,25.76 30.63,24.84 30.63,24.38 COMPARATOR_3.8 | 7.47,28.65 7.47,28.5 v7.32,28.35 | v31.85,18.9 31.24,18.29 | 31.55,29.26 32,29.72 38.86,29.72 39.47,29.11 39.47,26.67 37.03,24.23 37.03,22.25 35.2,20.42 35.2,20.12 R23.2 | v16.15,9.91 16.61,9.45
  Bottom 0.152: v45.57,9.14 45.57,16.15 C4.1 45.41,17.22 v45.41,18.29 45.41,18.59 44.04,19.96 31.85,19.96 | 13.56,17.68 14.78,17.68 24.38,27.28 24.38,28.5 | 13.56,17.68 v9.45,17.68 | 24.38,28.5 24.38,28.8 v23.77,29.41 23.47,29.72 v16.76,29.72 15.39,28.35 14.78,28.35 | 14.78,28.35 v7.32,28.35 | v7.16,24.38 9.3,24.38 11.89,26.98 14.48,26.98 14.78,27.28 14.78,28.35 | 13.56,17.68 13.56,14.63 13.87,14.33 14.02,14.33 14.78,13.56 14.78,12.95 v14.17,12.34 16.15,10.36 v16.15,9.91 | 31.85,19.96 31.85,22.55 27.13,27.28 27.13,28.19 26.82,28.5 24.38,28.5 | 31.85,19.96 v31.85,18.9
+12V  (via drill 0.35)
  Top 0.152: TSAL_LED_AND_POWER.5 43.43,27.89 46.94,24.38 46.94,23.47 CONVERTER_12VDC-5VDC.3 46.94,23.32 46.94,22.55 v43.74,19.36 | 36.12,1.68 40.54,1.68 41.3,2.44 R34.2 41.45,2.44 42.22,1.68 44.2,1.68 45.41,2.9 PMOS_1.2 | 36.12,1.68 35.05,1.68 PMOS_2.2 | 35.97,17.53 35.66,17.83 34.59,17.83 34.44,17.68 34.44,17.07 33.22,15.85 D1.2 | 35.97,17.53 35.97,16.31 35.2,15.54 C2.1 | v28.35,6.25 26.82,4.72 26.82,3.35 27.58,2.59 R30.2 | 35.97,17.53 37.8,17.53 37.95,17.68 39.32,17.68 40.23,16.76 C1.1 | v36.12,2.74 36.12,1.68
  Bottom 0.152: v28.35,6.25 29.72,6.25 34.29,10.82 | 34.29,10.82 40.23,16.76 C1.1 40.39,16.76 42.98,19.36 v43.74,19.36 | v36.12,2.74 36.12,7.92 36.27,8.08 36.27,8.84 34.29,10.82
AIR+_STATE  (via drill 0.35)
  Top 0.152: R2.2 8.38,16.61 4.27,16.61 3.81,16.15 CONTACTOR_STATE_AND_VOLTAGE_MEASUREMENT.5 3.81,16 1.37,13.56 1.37,11.58 1.98,10.97 v1.98,9.75 | v14.02,21.34 13.41,21.95 12.8,21.95 COMPARATOR_1.3 | v16,26.98 14.17,28.8 12.8,28.8 COMPARATOR_4.2
  Bottom 0.152: CONTACTOR_STATE_AND_VOLTAGE_MEASUREMENT.5 3.81,16.15 5.33,16.15 10.52,21.34 v14.02,21.34 14.02,21.79 16.15,23.93 16.15,24.54 16,24.69 v16,26.98 | v1.98,9.75 1.98,8.08 2.59,7.47 4.57,7.47 5.94,6.1 5.94,1.98 AIR+_STATE.1
AIR-_STATE  (via drill 0.35)
  Top 0.152: 3.81,13.72 5.94,15.85 8.99,15.85 9.75,16.61 10.52,16.61 R5.2 | v16.76,20.57 18.14,20.57 COMPARATOR_1.5 | v19.36,25.3 19.36,26.67 18.59,27.43 18.29,27.43 COMPARATOR_4.6 | 3.81,13.72 v1.98,11.89 | 3.81,13.72 CONTACTOR_STATE_AND_VOLTAGE_MEASUREMENT.4
  Bottom 0.152: CONTACTOR_STATE_AND_VOLTAGE_MEASUREMENT.4 3.81,13.72 8.38,18.29 14.48,18.29 v16.76,20.57 19.36,23.16 v19.36,25.3 | v1.98,11.89 1.98,10.67 2.59,10.06 4.42,10.06 8.38,6.1 8.38,1.98 AIR-_STATE.1
GND  (via drill 0.35)
  Top 0.152: R19.1 3.81,24.38 3.35,24.38 1.83,25.91 C9.2 | 4.27,24.08 3.96,24.38 R19.1 | 4.27,24.08 5.33,23.01 6.1,23.01 R6.1 | 4.27,24.08 6.1,25.91 C12.2 6.1,26.06 5.33,26.82 5.33,29.72 5.64,30.02 6.86,30.02 7.62,29.26 8.38,29.26 R22.1 8.38,29.11 9.14,29.11 9.91,28.35 11.12,28.35 11.73,28.96 11.73,29.26 11.89,29.41 14.02,29.41 15.24,28.19 19.96,28.19 20.42,27.74 R41.1 20.42,27.58 20.42,26.36 R39.1 20.57,26.36 21.49,26.36 | 4.27,24.08 R19.1 | R3.1 3.81,18.29 3.35,18.29 1.83,19.81 C17.2 1.83,19.96 1.83,21.18 C16.2 1.83,21.34 2.13,21.34 v2.9,22.1 | 21.49,26.36 22.55,26.36 C14.2 | v16.76,25.76 15.54,25.76 15.09,26.21 12.8,26.21 COMPARATOR_4.4 | 21.49,26.36 v21.49,25.45 | R15.1 10.52,11.89 8.38,11.89 R14.1 R9.1 8.38,10.36 7.92,9.91 7.77,9.91 7.01,9.14 7.01,7.01 | R5.1 10.52,15.09 8.38,15.09 R2.1 8.38,14.94 7.77,14.94 5.64,12.8 5.64,10.67 4.57,9.6 2.74,9.6 1.98,8.84 1.98,8.08 3.05,7.01 7.01,7.01 | 7.01,7.01 8.38,5.64 C5.1 8.38,5.49 10.52,5.49 R8.1 10.67,5.64 12.65,5.64 COMPARATOR_2.4 12.8,5.79 13.11,5.79 15.54,8.23 15.54,17.83 17.07,19.36 | R12.1 22.55,10.52 22.55,11.73 C8.2 22.71,11.89 23.47,12.65 23.47,13.56 24.23,14.33 25.91,14.33 | 25.91,14.33 26.21,14.02 26.21,12.04 25.45,11.28 25.15,11.28 D_FLIP_FLOP.7 | R21.1 10.67,21.18 12.19,21.18 12.65,20.73 COMPARATOR_1.4 | AND.3 10.36,19.66 11.73,19.66 12.65,20.57 COMPARATOR_1.4 | 19.05,18.29 18.9,18.29 18.29,18.9 XNOR.7 18.14,19.05 17.37,19.05 17.07,19.36 | 19.05,18.29 19.66,17.68 19.66,17.53 20.42,16.76 C6.1 20.57,16.76 22.55,16.76 C18.2 22.71,16.76 22.86,16.92 25.91,16.92 26.21,16.61 26.21,14.63 25.91,14.33
  Top 0.152: 19.05,18.29 19.81,19.05 21.03,19.05 21.79,19.81 22.55,19.81 C11.2 22.71,19.96 24.38,19.96 24.99,20.57 COMPARATOR_3.4 26.67,20.57 27.58,19.66 32.92,19.66 | 17.07,19.36 v15.85,20.57 12.8,20.57 COMPARATOR_1.4 | 22.55,2.44 22.4,2.44 21.95,1.98 GND.1 | 22.55,2.44 23.32,2.44 R28.2 | 22.55,2.44 22.55,5.49 C7.2 22.71,5.64 23.93,6.86 33.53,6.86 33.68,6.71 35.05,6.71 | R32.2 37.19,2.59 35.05,4.72 35.05,5.49 NMOS_2.2 35.05,5.64 35.05,6.71 | 35.05,6.71 35.05,9.45 OR.3 34.9,9.6 34.9,10.82 34.44,11.28 34.44,13.56 | v28.8,26.67 28.5,26.36 25.15,26.36 COMPARATOR_5.4 | C15.2 47.55,15.09 47.55,16.31 47.09,16.76 C4.2 46.63,16.76 45.72,17.68 42.82,17.68 | v46.33,8.53 47.4,8.53 NMOS_1.2 | 38.86,16.31 38.41,16.76 C1.2 | 38.86,16.31 39.32,15.85 41,15.85 41.76,16.61 C3.2 41.91,16.76 42.82,17.68 | 38.86,16.31 37.64,15.09 IC12.1 37.49,14.94 36.27,14.94 35.2,13.87 C2.2 35.05,13.72 34.9,13.56 34.44,13.56 | 32.92,19.66 32.92,19.96 R24.1 32.92,19.66 | 32.92,19.66 32.92,18.75 C10.2 32.77,18.59 32.77,18.29 32.16,17.68 32.16,14.48 33.07,13.56 D1.1 33.22,13.56 34.44,13.56 | 34.44,13.56 34.44,16.31 35.05,16.92 C13.2 | 42.82,17.68 40.23,20.27 40.23,21.03 CONVERTER_12VDC-5VDC.4 40.23,21.18 40.84,21.79 40.84,27.89 TSAL_LED_AND_POWER.4
  Bottom 0.152: v16.76,25.76 18.9,25.76 19.05,25.91 21.03,25.91 v21.49,25.45 | v2.9,22.1 7.47,22.1 10.21,24.84 14.17,24.84 15.39,26.06 15.39,27.28 15.7,27.58 16.31,27.58 16.76,27.13 v16.76,25.76 | v16.76,25.76 16.76,21.49 v15.85,20.57 | v28.8,26.67 32.31,26.67 32.92,26.06 39.01,26.06 TSAL_LED_AND_POWER.4 | v46.33,8.53 46.33,16.15 46.94,16.76 C4.2
GREEN_ENABLE  (via drill 0.35)
  Top 0.152: v25.45,5.33 25.45,4.27 R31.2 | R25.1 10.67,29.26 11.28,29.26 12.04,30.02 12.65,30.02 COMPARATOR_4.1 12.8,30.02 13.87,30.02 14.94,28.96 18.14,28.96 COMPARATOR_4.7 18.29,28.96 18.59,28.96 19.81,30.18 21.79,30.18 | 21.79,30.18 24.99,30.18 COMPARATOR_5.1 | 26.52,28.19 23.62,28.19 23.16,28.65 21.95,28.65 21.79,28.8 21.79,30.18 | 26.52,28.19 27.74,28.19 28.35,28.8 30.48,28.8 COMPARATOR_5.7 | v16.92,18.29 v16.92,13.26 | 26.52,28.19 v26.52,27.89
  Bottom 0.152: 17.68,5.33 15.7,5.33 14.33,3.96 14.33,1.98 GREEN_ENABLE.1 | 17.68,5.33 v25.45,5.33 | 17.68,5.33 17.68,12.5 v16.92,13.26 | v26.52,27.89 v16.92,18.29
GREEN_ON
  Top 0.152: TSAL_LED_AND_POWER.2 35.81,25.15 33Ω_2_.1
IMPLAUSIBILITY
  Top 0.152: 25.3,9.3 24.84,8.84 OPTO_2.1 | 25.3,9.3 25.45,9.45 32,9.45 32.16,9.3 32.16,9.14 32.61,8.69 33.53,8.69 33.98,9.14 33.98,9.45 OR.2 | 25.3,9.3 24.23,10.36 | 24.23,10.36 24.08,10.52 24.08,12.95 24.23,13.11 24.38,13.11 24.99,13.72 D_FLIP_FLOP.5 | 24.23,10.36 23.47,9.6 19.96,9.6 19.2,8.84 16.46,8.84 16.15,8.53 16.15,7.01 12.95,3.81 IMPLAUSIBILITY.1
N$1  (via drill 0.35)
  Top 0.152: R1.1 3.96,21.18 3.96,19.96 R3.2 3.96,19.81 4.72,19.05 v5.03,19.05 | v9.45,22.1 11.12,22.1 12.19,23.16 12.65,23.16 COMPARATOR_1.2
  Bottom 0.152: v9.45,22.1 7.92,22.1 5.03,19.2 v5.03,19.05
N$2  (via drill 0.35)
  Top 0.152: 14.94,24.54 12.8,24.54 COMPARATOR_1.1 | 14.94,24.54 15.24,24.84 16.46,24.84 18.14,23.16 COMPARATOR_1.7 | 9.3,20.27 9.45,20.12 9.45,18.75 9.75,18.44 10.21,18.44 AND.1 | 9.3,20.27 8.38,21.18 R13.1 | v14.17,18.9 14.78,18.29 14.78,11.58 12.8,9.6 COMPARATOR_2.1 | 9.3,20.27 v11.43,20.27 | 14.94,24.54 14.94,23.32 v15.7,22.55
  Bottom 0.152: v11.43,20.27 12.8,18.9 v14.17,18.9 14.17,19.81 15.7,21.34 v15.7,22.55
N$3  (via drill 0.35)
  Top 0.152: R6.2 6.1,20.12 | 6.1,20.12 R4.1 | v14.17,22.86 15.09,21.95 18.14,21.95 COMPARATOR_1.6 | 6.1,20.12 v7.32,20.12
  Bottom 0.152: v14.17,22.86 11.58,22.86 8.84,20.12 v7.32,20.12
N$4
  Top 0.152: R9.2 10.52,8.69 R7.1 10.67,8.53 10.82,8.38 12.65,8.38 COMPARATOR_2.2
N$5
  Top 0.152: R12.2 22.55,8.69 20.57,8.69 R10.1 20.42,8.69 18.75,7.01 18.29,7.01 COMPARATOR_2.6
N$6
  Top 0.152: C7.1 22.55,7.32 20.57,7.32 R11.1 20.42,7.16 19.05,5.79 18.29,5.79 COMPARATOR_2.5
N$7  (via drill 0.35)
  Top 0.152: D_FLIP_FLOP.3 24.99,16.15 24.69,15.85 19.81,15.85 19.66,15.7 19.66,12.95 20.42,12.19 20.42,11.89 R16.2 20.42,11.73 19.36,10.67 18.9,10.67 18.59,10.36 v17.07,10.36 | v16.76,8.23 18.14,8.23 COMPARATOR_2.7 | v29.11,23.16 30.48,23.16 COMPARATOR_3.7
  Bottom 0.152: v16.76,8.23 16.76,10.06 v17.07,10.36 16.31,11.12 16.31,13.56 16.61,13.87 22.4,13.87 29.57,21.03 29.57,21.64 29.11,22.1 v29.11,23.16
N$8
  Top 0.152: AND.2 10.97,19.05 11.73,18.29 11.73,15.85 12.34,15.24 12.65,15.24 XNOR.11
N$9
  Top 0.152: R23.1 35.05,21.79 32.92,21.79 R24.2 32.77,21.95 32.31,22.4 28.96,22.4 28.5,22.86 28.5,23.77 30.48,25.76 30.48,26.21 COMPARATOR_5.5
N$10  (via drill 0.35)
  Top 0.152: R21.2 10.52,23.01 10.52,24.23 R18.1 10.67,24.23 11.89,25.45 v13.87,25.45 | v23.77,27.58 24.99,27.58 COMPARATOR_5.3
  Bottom 0.152: v23.77,27.58 16.76,27.58 16.46,27.89 15.54,27.89 15.09,27.43 15.09,26.67 v13.87,25.45
N$11  (via drill 0.35)
  Top 0.152: v5.03,26.06 3.96,26.06 R19.2 | v7.16,26.52 6.25,27.43 R17.1 | v14.17,27.58 12.8,27.58 COMPARATOR_4.3
  Bottom 0.152: v5.03,26.06 6.71,26.06 v7.16,26.52 8.23,27.58 v14.17,27.58
N$12
  Top 0.152: R22.2 R20.1 8.38,25.91 9.14,25.15 11.12,25.15 11.43,25.45 11.43,26.36 12.04,26.98 14.78,26.98 15.39,26.36 18.14,26.36 COMPARATOR_4.5
N$14  (via drill 0.35)
  Top 0.152: R39.2 20.42,24.54 20.42,23.16 R26.1 20.57,23.01 21.34,22.25 23.16,22.25 23.47,21.95 v23.77,21.95 | COMPARATOR_3.5 29.72,20.57 v28.96,21.34
  Bottom 0.152: v28.96,21.34 28.96,21.64 26.82,23.77 25.6,23.77 v23.77,21.95
N$15  (via drill 0.35)
  Top 0.152: v32.77,3.81 33.98,3.81 PMOS_2.3
  Bottom 0.152: v32.77,3.81 32.31,3.81 32.16,3.96 20.73,3.96 33Ω_2.1 18.14,3.81 680Ω.1
N$16
  Top 0.152: R28.1 23.47,4.27 23.47,4.88 24.69,6.1 OPTO_2.2
N$17  (via drill 0.35)
  Top 0.152: v46.33,3.81 47.4,3.81 PMOS_1.3
  Bottom 0.152: v46.33,3.81 38.1,3.81 36.27,1.98 31.7,1.98 33Ω_1.1
N$18
  Top 0.152: NMOS_2.3 33.98,7.77 32.16,7.77 31.24,8.69 OPTO_2.4
N$19
  Top 0.152: R30.1 27.74,4.27 29.72,4.27 R29.1 29.87,4.27 31.09,5.49 31.09,6.1 OPTO_2.3
N$20  (via drill 0.35)
  Top 0.152: 31.85,3.05 32,3.05 33.07,1.98 33.07,1.68 PMOS_2.1 | 31.85,3.05 31.24,3.05 30.79,2.59 29.87,2.59 R29.2 | v31.85,3.35 31.85,3.05
  Bottom 0.152: v31.85,3.35 21.64,3.35 21.03,2.74 19.96,2.74 19.81,2.9 18.75,2.9 17.83,1.98 16.76,1.98 GREEN_ON_PMOS.1
N$21
  Top 0.152: R31.1 25.6,2.44 26.21,2.44 26.98,1.68 28.35,1.68 28.96,2.29 28.96,3.05 29.26,3.35 30.94,3.35 33.07,5.49 NMOS_2.1
N$22
  Top 0.152: NMOS_1.3 44.5,7.62 43.43,8.69 OPTO_1.4
N$23
  Top 0.152: R33.1 43.43,2.59 42.98,2.59 41.45,4.12 R34.1 41.45,4.27 43.28,6.1 OPTO_1.3
N$24
  Top 0.152: R33.2 43.43,4.27 44.81,4.27 45.41,4.88 PMOS_1.1
N$25
  Top 0.152: R35.1 39.32,4.27 39.93,4.27 42.52,6.86 47.24,6.86 47.4,6.71 NMOS_1.1
N$26
  Top 0.152: R32.1 37.19,4.27 37.19,6.1 OPTO_1.2
N$27  (via drill 0.35)
  Top 0.152: v33.07,10.82 33.07,9.6 OR.1 | COMPARATOR_3.1 v26.52,24.38
  Bottom 0.152: v33.07,10.82 33.07,16.76 29.87,19.96 29.87,23.32 28.8,24.38 v26.52,24.38
N$28
  Top 0.152: OR.4 35.05,12.04 35.05,11.12 37.03,9.14 37.03,8.84 OPTO_1.1
N$30
  Top 0.152: C14.1 22.55,24.54 22.55,23.16 R27.1 22.71,23.01 23.16,22.55 26.67,22.55 27.28,21.95 30.48,21.95 COMPARATOR_3.6
N$31  (via drill 0.35)
  Top 0.152: R37.2 45.57,10.21 v44.5,11.28 43.43,12.34 42.98,12.34 IC12.6 42.82,12.5 40.84,10.52 36.73,10.52 36.42,10.82 36.42,12.8 36.73,13.11 36.88,13.11 37.49,13.72 IC12.2 | v44.5,14.63 44.81,14.33 46.02,14.33 46.94,13.41 47.55,13.41 C15.1
  Bottom 0.152: v44.5,11.28 v44.5,14.63
N$32
  Top 0.152: R36.2 47.55,11.89 45.72,11.89 R37.1 45.57,12.04 44.81,12.04 43.13,13.72 IC12.7 42.82,13.72 40.39,11.28 37.64,11.28 IC12.4
N$33
  Top 0.152: R41.2 20.57,29.41 22.25,27.74 22.55,27.74 R40.1 22.71,27.58 23.47,26.82 23.47,24.54 24.23,23.77 24.38,23.77 24.99,23.16 COMPARATOR_3.2
N$34
  Top 0.152: R42.1 20.57,18.29 22.55,18.29 C11.1 22.71,18.29 25.15,18.29 | 25.15,18.29 25.15,18.75 D_FLIP_FLOP.1 | 25.15,18.29 25.15,17.53 D_FLIP_FLOP.2
N$35  (via drill 0.35)
  Top 0.152: v15.54,24.23 17.22,22.55 19.05,22.55 19.2,22.4 19.2,21.18 20.42,19.96 R42.2 | v7.32,19.2 7.92,19.2 8.38,19.66 AND.4
  Bottom 0.152: v15.54,24.23 12.5,24.23 8.99,20.73 7.01,20.73 6.71,20.42 6.71,19.81 v7.32,19.2
PRE_STATE  (via drill 0.35)
  Top 0.152: COMPARATOR_2.3 12.65,7.01 12.5,7.16 10.67,7.16 R8.2 10.52,7.16 v9.45,6.1 | v27.43,28.8 25.15,28.8 COMPARATOR_5.2
  Bottom 0.152: PRE_STATE.1 10.97,2.13 10.97,3.96 9.45,5.49 v9.45,6.1 8.84,6.1 3.81,11.12 | v27.43,28.8 25.3,28.8 23.77,30.33 8.38,30.33 1.98,23.93 1.98,12.95 3.81,11.12 | 3.81,11.12 CONTACTOR_STATE_AND_VOLTAGE_MEASUREMENT.3
RED_ENABLE  (via drill 0.35)
  Top 0.152: 38.25,8.08 38.25,9.14 37.19,10.21 36.58,10.21 36.12,10.67 36.12,13.72 36.73,14.33 38.41,14.33 | 38.25,8.08 38.25,3.5 39.17,2.59 R35.2 | 38.41,14.33 38.56,14.17 38.56,13.26 37.64,12.34 IC12.3 | 38.41,14.33 43.89,14.33 44.81,13.41 45.57,13.41 R38.2 | v35.66,8.38 35.97,8.38 36.27,8.08 38.25,8.08
  Bottom 0.152: v35.66,8.38 32,4.72 25.15,4.72 24.99,4.88 17.68,4.88 16.61,3.81 15.54,3.81 RED_ENABLE.1
RED_ON
  Top 0.152: TSAL_LED_AND_POWER.3 38.25,27.89 38.25,25.91 35.97,23.62 33Ω_1_.1
TS_OFF
  Top 0.152: TSAL_LED_AND_POWER.1 33.22,27.89 33.22,24.38 32.46,23.62 680Ω_.1
VOLTAGE_ON_ACCUMULATOR  (via drill 0.35)
  Top 0.152: v26.52,21.79 25.15,21.79 COMPARATOR_3.3 | v26.52,23.16 26.52,23.47 29.41,26.36 29.41,26.67 30.18,27.43 30.48,27.43 COMPARATOR_5.6 | CONTACTOR_STATE_AND_VOLTAGE_MEASUREMENT.2 3.81,8.38 5.94,10.52 5.94,10.82 7.77,12.65 8.99,12.65 9.75,13.41 10.52,13.41 R15.2 10.67,13.56 12.5,13.56 12.65,13.72 XNOR.12 12.8,13.87 13.11,13.87 v14.17,14.94
  Bottom 0.152: v26.52,23.16 v26.52,21.79 24.54,21.79 17.68,14.94 v14.17,14.94 | VOLTAGE_ON_ACCUMULATOR.1 7.16,3.81 7.16,5.33 4.12,8.38 3.81,8.38 CONTACTOR_STATE_AND_VOLTAGE_MEASUREMENT.2
VOLTAGE_ON_INVERTER  (via drill 0.35)
  Top 0.152: v7.16,13.41 8.38,13.41 R14.2 | v14.17,13.26 13.41,13.26 12.8,12.65 XNOR.13 | CONTACTOR_STATE_AND_VOLTAGE_MEASUREMENT.1 3.81,5.94 6.55,5.94 8.69,3.81 9.75,3.81 VOLTAGE_ON_INVERTER.1 10.67,4.57 v11.43,4.57
  Bottom 0.152: 11.43,13.41 14.02,13.41 v14.17,13.26 | 11.43,13.41 v7.16,13.41 | v11.43,4.57 11.43,13.41